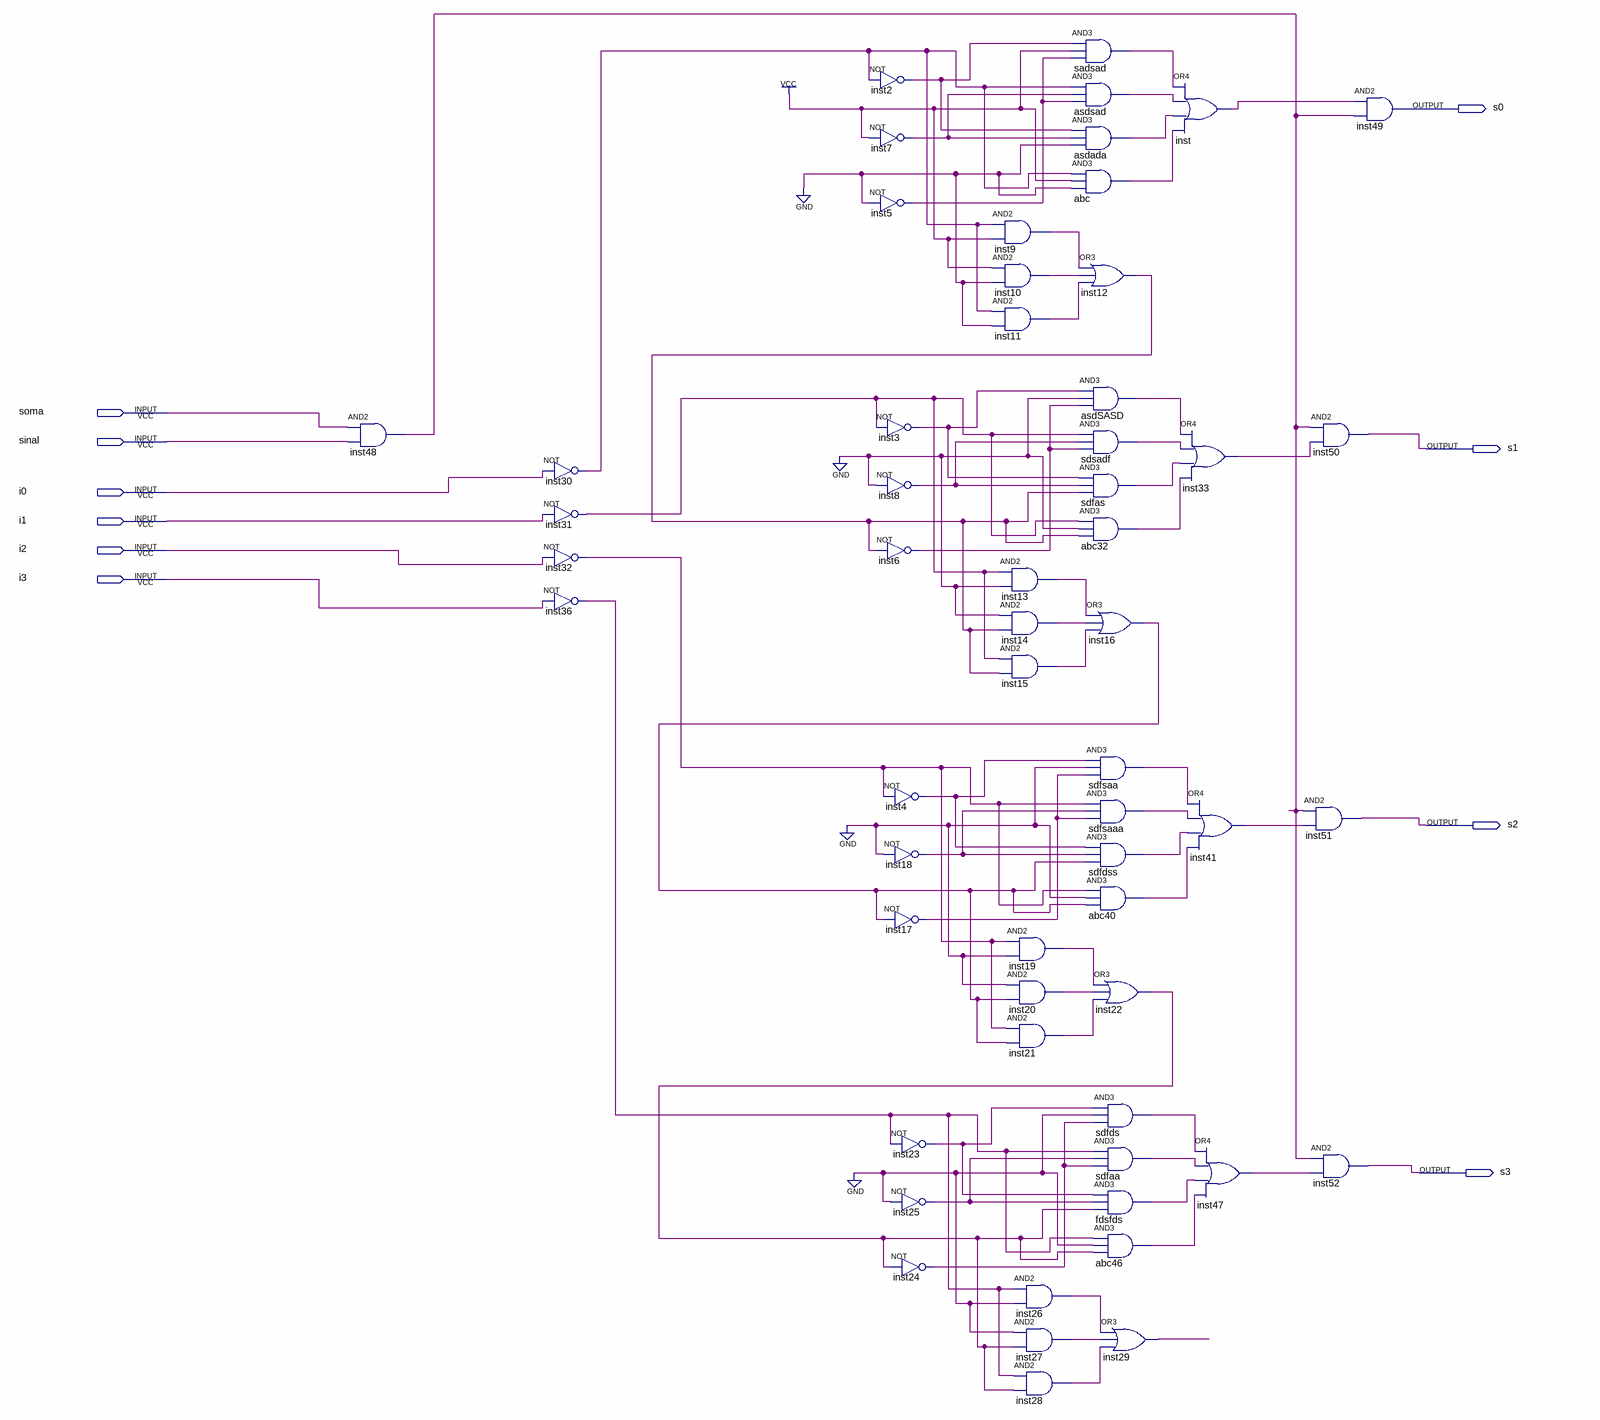
[diagram p0: schematic sheet]
// Quartus schematic complemento2.bdf as structural Verilog: 57 symbols, 10 pins
module complemento2 (
  input  soma,
  input  sinal,
  input  i0,
  input  i1,
  input  i2,
  input  i3,
  output s0,
  output s1,
  output s2,
  output s3
);

  wire abc32_out, abc40_out, abc46_out, abc_out, asdada_out, asdsad_out, asdSASD_out, fdsfds_out, inst2_out,
       inst3_out, inst4_out, inst5_out, inst6_out, inst7_out, inst8_out, inst9_out, inst10_out, inst11_out,
       inst12_out, inst13_out, inst14_out, inst15_out, inst16_out, inst17_out, inst18_out, inst19_out,
       inst20_out, inst21_out, inst22_out, inst23_out, inst24_out, inst25_out, inst26_out, inst27_out,
       inst28_out, inst29_out, inst30_out, inst31_out, inst32_out, inst33_out, inst36_out, inst41_out,
       inst47_out, inst48_out, inst_out, sadsad_out, sdfaa_out, sdfas_out, sdfds_out, sdfdss_out, sdfsaa_out,
       sdfsaaa_out, sdsadf_out;

  and inst48 (inst48_out, soma, sinal);
  not inst30 (inst30_out, i0);
  not inst31 (inst31_out, i1);
  not inst32 (inst32_out, i2);
  not inst36 (inst36_out, i3);
  not inst2 (inst2_out, inst30_out);
  not inst7 (inst7_out, 1'b1);
  not inst5 (inst5_out, 1'b0);
  not inst3 (inst3_out, inst31_out);
  not inst8 (inst8_out, 1'b0);
  not inst6 (inst6_out, inst12_out);
  not inst4 (inst4_out, inst32_out);
  not inst18 (inst18_out, 1'b0);
  not inst17 (inst17_out, inst16_out);
  not inst23 (inst23_out, inst36_out);
  not inst25 (inst25_out, 1'b0);
  not inst24 (inst24_out, inst22_out);
  and inst9 (inst9_out, inst30_out, 1'b1);
  and inst10 (inst10_out, 1'b1, 1'b0);
  and inst11 (inst11_out, inst30_out, 1'b0);
  and inst13 (inst13_out, inst31_out, 1'b0);
  and inst14 (inst14_out, 1'b0, inst12_out);
  and inst15 (inst15_out, inst31_out, inst12_out);
  and inst19 (inst19_out, inst32_out, 1'b0);
  and inst20 (inst20_out, 1'b0, inst16_out);
  and inst21 (inst21_out, inst32_out, inst16_out);
  and inst26 (inst26_out, inst36_out, 1'b0);
  and inst27 (inst27_out, 1'b0, inst22_out);
  and inst28 (inst28_out, inst36_out, inst22_out);
  and sadsad (sadsad_out, inst2_out, 1'b1, inst5_out);
  and asdsad (asdsad_out, inst30_out, inst7_out, inst5_out);
  and asdada (asdada_out, inst2_out, inst7_out, 1'b0);
  and abc (abc_out, inst30_out, 1'b1, 1'b0);
  or inst12 (inst12_out, inst9_out, inst10_out, inst11_out);
  and asdSASD (asdSASD_out, inst3_out, 1'b0, inst6_out);
  and sdsadf (sdsadf_out, inst31_out, inst8_out, inst6_out);
  and sdfas (sdfas_out, inst3_out, inst8_out, inst12_out);
  and abc32 (abc32_out, inst31_out, 1'b0, inst12_out);
  or inst16 (inst16_out, inst13_out, inst14_out, inst15_out);
  and sdfsaa (sdfsaa_out, inst4_out, 1'b0, inst17_out);
  and sdfsaaa (sdfsaaa_out, inst32_out, inst18_out, inst17_out);
  and sdfdss (sdfdss_out, inst4_out, inst18_out, inst16_out);
  and abc40 (abc40_out, inst32_out, 1'b0, inst16_out);
  or inst22 (inst22_out, inst19_out, inst20_out, inst21_out);
  and sdfds (sdfds_out, inst23_out, 1'b0, inst24_out);
  and sdfaa (sdfaa_out, inst36_out, inst25_out, inst24_out);
  and fdsfds (fdsfds_out, inst23_out, inst25_out, inst22_out);
  and abc46 (abc46_out, inst36_out, 1'b0, inst22_out);
  or inst29 (inst29_out, inst26_out, inst27_out, inst28_out);
  or inst (inst_out, sadsad_out, asdsad_out, asdada_out, abc_out);
  or inst33 (inst33_out, asdSASD_out, sdsadf_out, sdfas_out, abc32_out);
  or inst41 (inst41_out, sdfsaa_out, sdfsaaa_out, sdfdss_out, abc40_out);
  or inst47 (inst47_out, sdfds_out, sdfaa_out, fdsfds_out, abc46_out);
  and inst50 (s1, inst48_out, inst33_out);
  and inst51 (s2, inst48_out, inst41_out);
  and inst52 (s3, inst48_out, inst47_out);
  and inst49 (s0, inst_out, inst48_out);
endmodule
